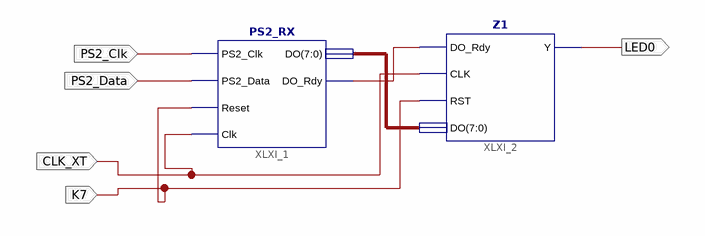
[diagram p0: schematic sheet 1]
// Xilinx ISE schematic Z1schemat.sch (xc9500xl) as structural Verilog: 2 symbols, 5 ports
module Z1schemat (
  input  PS2_Clk,
  input  PS2_Data,
  input  K7,
  input  CLK_XT,
  output LED0
);

  wire XLXN_2;
  wire [7:0] XLXN_1;

  PS2_RX XLXI_1 (.PS2_Clk(PS2_Clk), .PS2_Data(PS2_Data), .Clk(CLK_XT), .Reset(K7), .DO_Rdy(XLXN_2), .DO(XLXN_1));
  Z1 XLXI_2 (.DO_Rdy(XLXN_2), .CLK(CLK_XT), .RST(K7), .DO(XLXN_1), .Y(LED0));
endmodule
